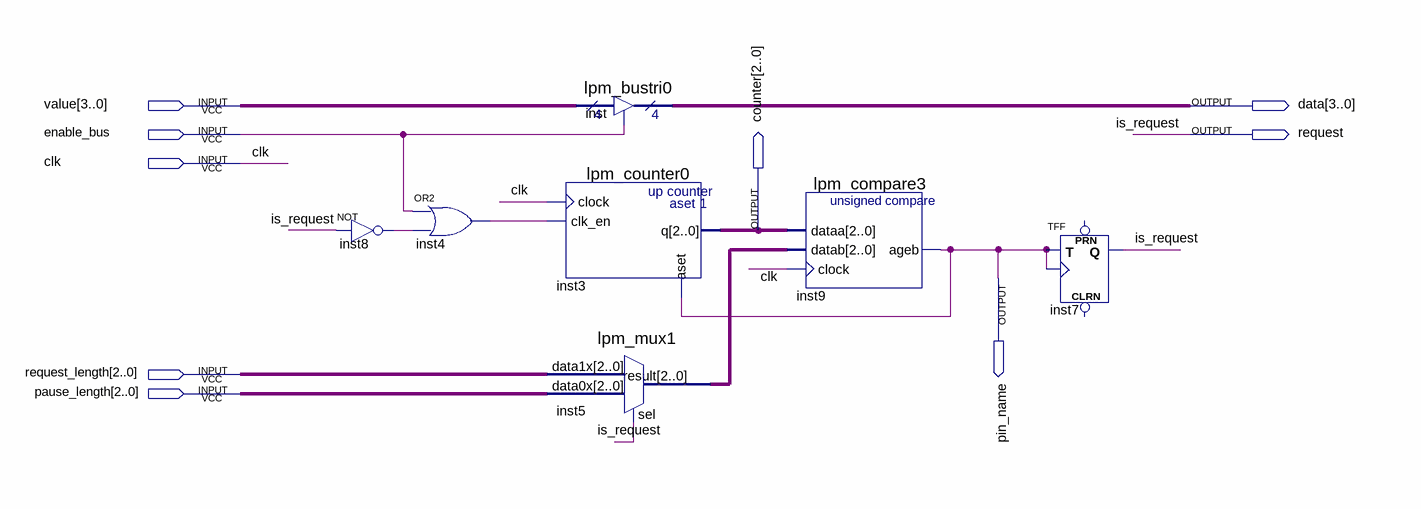
[diagram p0: schematic sheet]
// Quartus schematic master_device.bdf as structural Verilog: 7 symbols, 9 pins
module master_device (
  input  [3:0] value,
  input  enable_bus,
  input  clk,
  input  [2:0] request_length,
  input  [2:0] pause_length,
  output [3:0] data,
  output request,
  output [2:0] counter,
  output pin_name
);

  wire inst4_out, inst8_out;
  wire [2:0] inst5_result;

  not inst8 (inst8_out, request);
  or inst4 (inst4_out, enable_bus, inst8_out);
  lpm_counter0 inst3 (.clock(clk), .clk_en(inst4_out), .aset(pin_name), .q(counter));
  lpm_mux1 inst5 (.data1x(request_length), .data0x(pause_length), .sel(request), .result(inst5_result));
  lpm_bustri0 inst (.enabledt(enable_bus), .data(value), .tridata(data));
  lpm_compare3 inst9 (.dataa(counter), .datab(inst5_result), .clock(clk), .ageb(pin_name));
  TFF inst7 (.T(pin_name), .CLK(pin_name), .Q(request));  // open: PRN, CLRN

  // Other names for the same wires on the sheet: is_request = request
endmodule
